# Altium project analog.PrjPcb
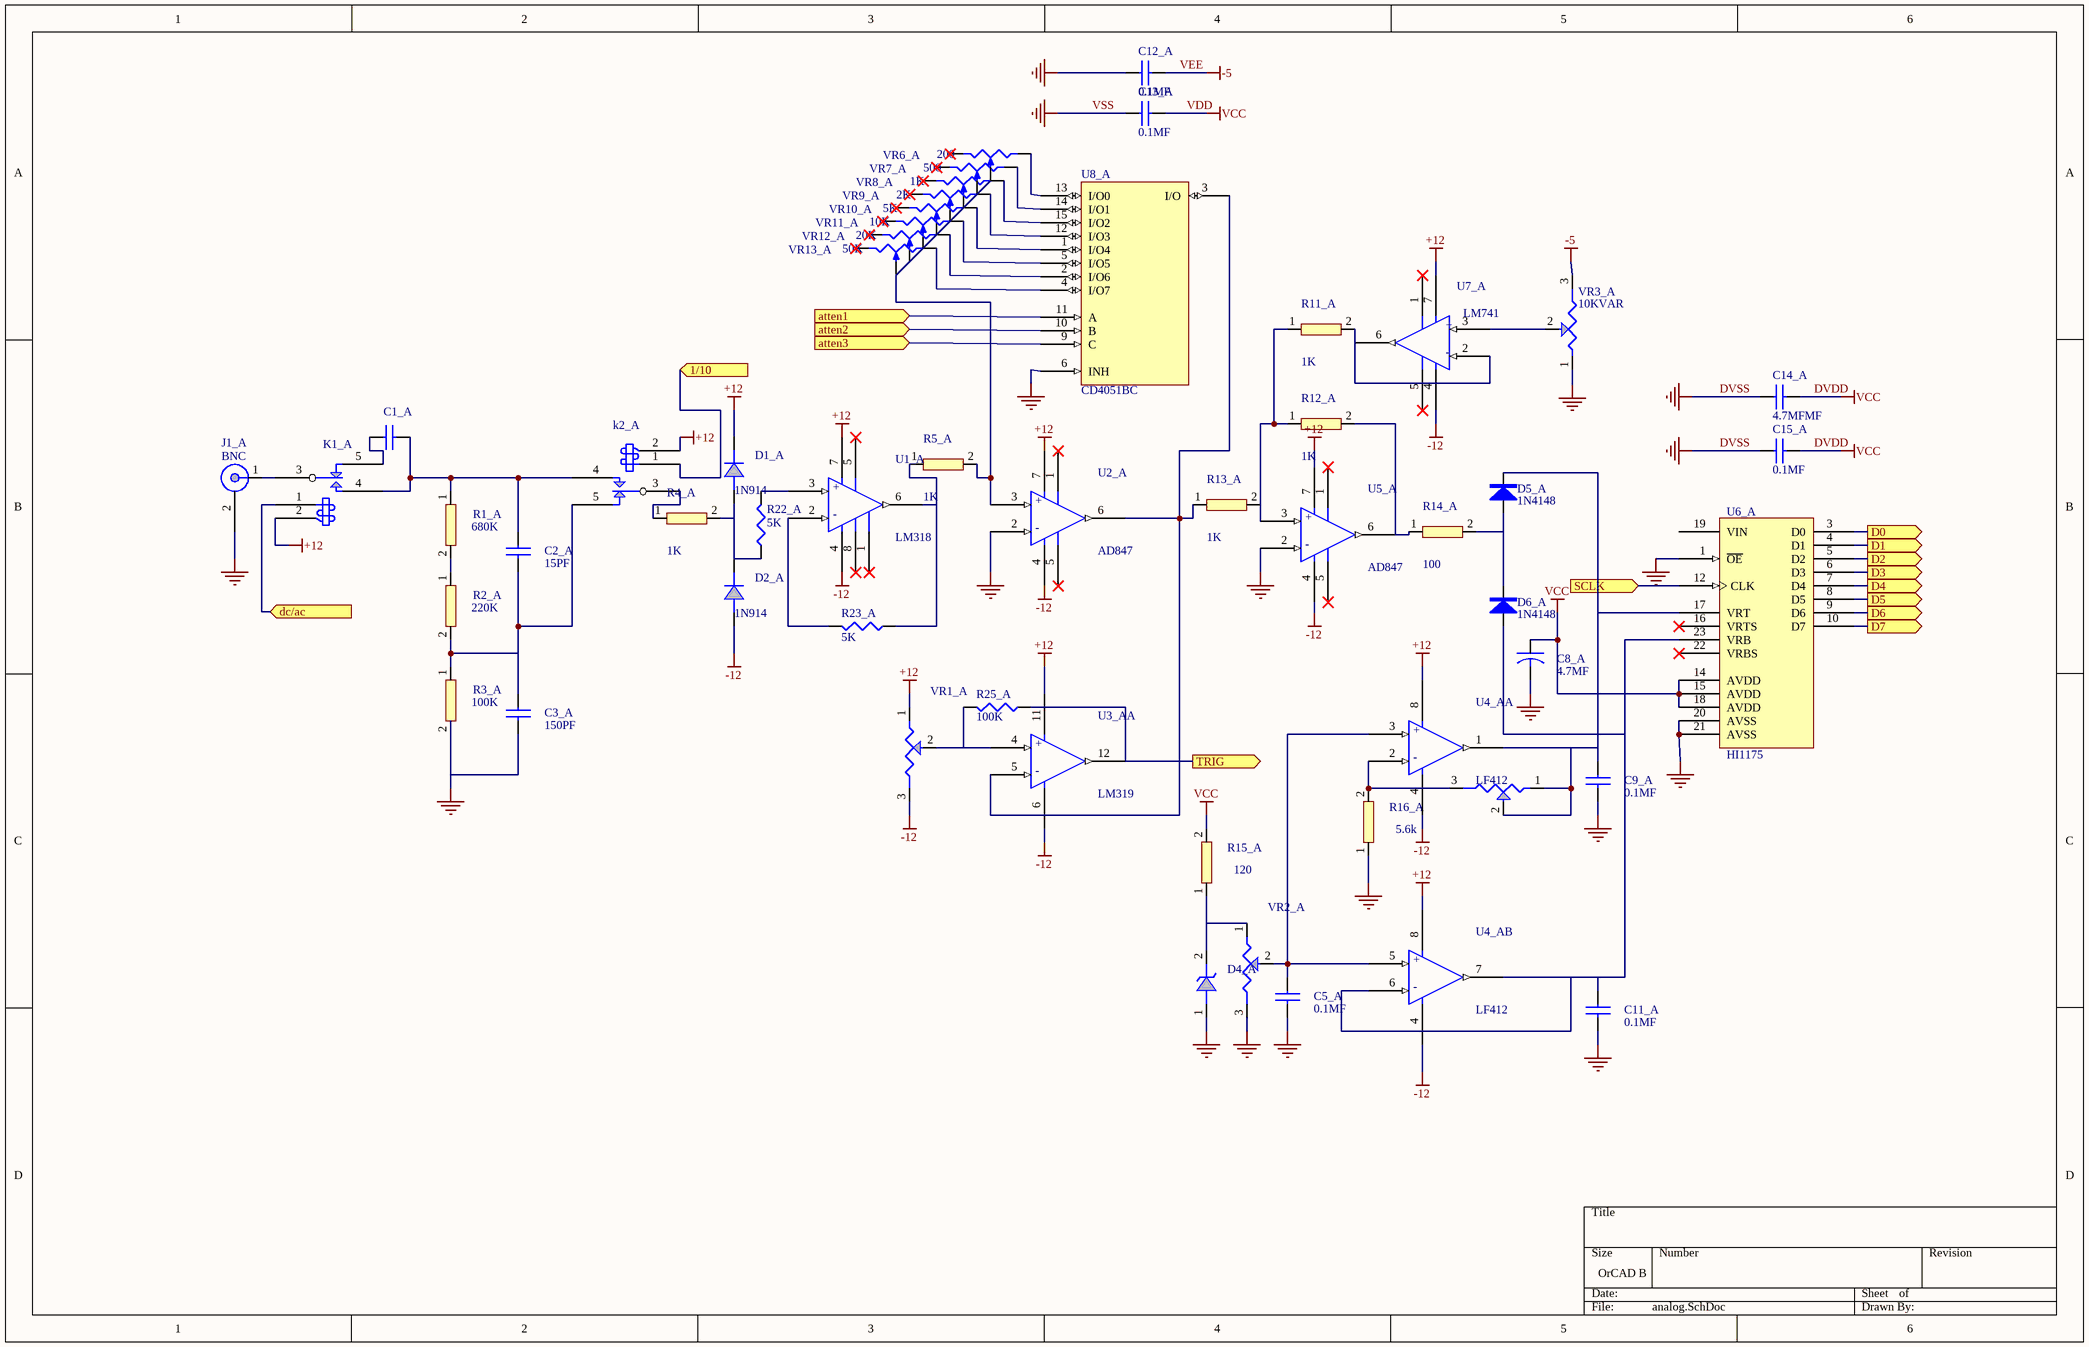
[diagram p0: analog.SchDoc]
1 sheet, 53 parts. Net scope: flat (ports and power ports of the same name join across sheets).

## Sheet analog.SchDoc: RevCode
size OrCAD B; DocumentNumber: Page Create Date; Revision: TitleBlock0; SheetNumber: 1; SheetTotal: 1

### Parts
C1_A  0.1MF  [RAD0.2]  (value not drawn)
C2_A  15PF  [RAD0.2]
C3_A  150PF  [RAD0.2]
C5_A  0.1MF  [RAD0.2]
C8_A  4.7MF  [RAD0.2]
C9_A  0.1MF  [RAD0.2]
C11_A  0.1MF  [RAD0.2]
C12_A  0.1MF  [RAD0.2]
C13_A  0.1MF  [RAD0.2]
C14_A  4.7MFMF  [RAD0.2]
C15_A  0.1MF  [RAD0.2]
D1_A  1N914  [DIODE-0.4]
D2_A  1N914  [DIODE-0.4]
D4_A  ICL8069  [TO46]  (value not drawn)
D5_A  1N4148  [DIODE-0.4]
D6_A  1N4148  [DIODE-0.4]
J1_A  BNC  [BNC_AMP_H]
K1_A  RELAY SPDT  [RELAY41]  (value not drawn)
k2_A  RELAY SPDT  [RELAY41]  (value not drawn)
R1_A  680K  [AXIAL0.3]
R2_A  220K  [AXIAL0.3]
R3_A  100K  [AXIAL0.3]
R4_A  1K  [AXIAL0.3]
R5_A  1K  [AXIAL0.3]
R11_A  1K  [AXIAL0.3]
R12_A  1K  [AXIAL0.3]
R13_A  1K  [AXIAL0.3]
R14_A  100  [AXIAL0.3]
R15_A  120  [AXIAL0.3]
R16_A  5.6k  [AXIAL0.3]
R22_A  5K  [AXIAL0.3]
R23_A  5K  [AXIAL0.3]
R25_A  100K  [AXIAL0.3]
U1_A  LM318  [DIP8]
U2_A  AD847  [DIP8]
U3_A  LM319  [DIP14]  (part A of 2)
U4_A  LF412  [DIP8]  (parts A,B of 2)
U5_A  AD847  [DIP8]
U6_A  HI1175  [SOJ-24]
U7_A  LM741  [DIP8]
U8_A  CD4051BC  [DIP-16]
VR1_A  10KVAR  [VR5]  (value not drawn)
VR2_A  5kvar  [VR5]  (value not drawn)
VR3_A  10KVAR  [VR5]
VR4_A  5kvar  [VR5]  (value not drawn)
VR6_A  200  [VR5]
VR7_A  500  [VR5]
VR8_A  1K  [VR5]
VR9_A  2K  [VR5]
VR10_A  5K  [VR5]
VR11_A  10K  [VR5]
VR12_A  20K  [VR5]
VR13_A  50K  [VR5]

### Ports
1/10 (in), atten1 (in), atten2 (in), atten3 (in), D0 (out), D1 (out), D2 (out), D3 (out), D4 (out), D5 (out), D6 (out), D7 (out), dc/ac (in), SCLK (in), TRIG (out)

### Nets
+12: D1_A.2(CATHODE) K1_A.2(COIL2) k2_A.2(COIL2) U1_A.7(V+) U2_A.7(V+) U3_A.11(V+) U4_A.8(V+) U5_A.7(V+) U7_A.7(V+) VR1_A.1(A)
-12: D2_A.1(ANODE) U1_A.4(V-) U2_A.4(V-) U3_A.6(V-) U4_A.4(V-) U5_A.4(V-) U7_A.4(V-) VR1_A.3(B)
DVDD: C8_A.1 C13_A.2 C14_A.2 C15_A.2 R15_A.2 U6_A.11(DVDD) U6_A.13(DVDD) U6_A.14(AVDD) U6_A.15(AVDD) U6_A.18(AVDD) U8_A.16(VDD)  [also labelled VCC, VDD]
DVSS: C3_A.2 C5_A.2 C8_A.2 C9_A.2 C11_A.2 C12_A.1 C13_A.1 C14_A.1 C15_A.1 D4_A.1(ANODE) J1_A.2(SHIELD) R3_A.2 R16_A.1 U2_A.2(-IN) U3_A.3(GND) U5_A.2(-IN) U6_A.1(~{OE}) U6_A.2(DVSS) U6_A.20(AVSS) U6_A.21(AVSS) U6_A.24(DVSS) U8_A.6(INH) U8_A.8(VSS) VR2_A.3(B) VR3_A.1(A)  [also labelled GND, VSS]
VEE: C12_A.2 U8_A.7(VEE) VR3_A.3(B)  [also labelled -5]
NetC1_A_1: C1_A.1 K1_A.5(NC)
NetC1_A_2: C1_A.2 C2_A.1 K1_A.4(NO) k2_A.4(NO) R1_A.1
NetC2_A_2: C2_A.2 C3_A.1 k2_A.5(NC) R2_A.2 R3_A.1
NetC5_A_1: C5_A.1 U4_A.3(+IN) U4_A.5(+IN) VR2_A.2(WIPER)
NetC9_A_1: C9_A.1 D5_A.2(K) U4_A.1(OUT) U6_A.17(VRT) VR4_A.1(A) VR4_A.2(WIPER)
NetC11_A_1: C11_A.1 D6_A.1(A) U4_A.6(-IN) U4_A.7(OUT) U6_A.23(VRB)
NetD1_A_1: D1_A.1(ANODE) D2_A.2(CATHODE) R4_A.2 R22_A.2(BOT)
NetD4_A_2: D4_A.2(CATHODE) R15_A.1 VR2_A.1(A)
NetD5_A_1: D5_A.1(A) D6_A.2(K) R14_A.2
NetJ1_A_1: J1_A.1(CENTER) K1_A.3(COMMON)
NetK1_A_1: K1_A.1(COIL1) ; port dc/ac
Netk2_A_1: k2_A.1(COIL1) ; port 1/10
Netk2_A_3: k2_A.3(COMMON) R4_A.1
NetR1_A_2: R1_A.2 R2_A.1
NetR5_A_1: R5_A.1 R23_A.2(BOT) U1_A.6(OUT)
NetR5_A_2: R5_A.2 U2_A.3(+IN) VR6_A.3(TAP) VR7_A.3(TAP) VR8_A.3(TAP) VR9_A.3(TAP) VR10_A.3(TAP) VR11_A.3(TAP) VR12_A.3(TAP) VR13_A.3(TAP)
NetR11_A_1: R11_A.1 R12_A.1 R13_A.2 U5_A.3(+IN)
NetR11_A_2: R11_A.2 U7_A.2(-IN) U7_A.6(OUT)
NetR12_A_2: R12_A.2 R14_A.1 U5_A.6(OUT)
NetR13_A_1: R13_A.1 U2_A.6(OUT) U3_A.5(-IN) U8_A.3(I/O)
NetR16_A_2: R16_A.2 U4_A.2(-IN) VR4_A.3(B)
NetR22_A_1: R22_A.1(TOP) U1_A.3(+IN)
NetR23_A_1: R23_A.1(TOP) U1_A.2(-IN)
NetR25_A_1: R25_A.1(TOP) U3_A.4(+IN) VR1_A.2(WIPER)
NetR25_A_2: R25_A.2(BOT) U3_A.12(OUT) ; port TRIG
NetU6_A_3: U6_A.3(D0) ; port D0
NetU6_A_4: U6_A.4(D1) ; port D1
NetU6_A_5: U6_A.5(D2) ; port D2
NetU6_A_6: U6_A.6(D3) ; port D3
NetU6_A_7: U6_A.7(D4) ; port D4
NetU6_A_8: U6_A.8(D5) ; port D5
NetU6_A_9: U6_A.9(D6) ; port D6
NetU6_A_10: U6_A.10(D7) ; port D7
NetU6_A_12: U6_A.12(CLK) ; port SCLK
NetU7_A_3: U7_A.3(+IN) VR3_A.2(WIPER)
NetU8_A_1: U8_A.1(I/O4) VR10_A.2(BOT)
NetU8_A_2: U8_A.2(I/O6) VR12_A.2(BOT)
NetU8_A_4: U8_A.4(I/O7) VR13_A.2(BOT)
NetU8_A_5: U8_A.5(I/O5) VR11_A.2(BOT)
NetU8_A_9: U8_A.9(C) ; port atten3
NetU8_A_10: U8_A.10(B) ; port atten2
NetU8_A_11: U8_A.11(A) ; port atten1
NetU8_A_12: U8_A.12(I/O3) VR9_A.2(BOT)
NetU8_A_13: U8_A.13(I/O0) VR6_A.2(BOT)
NetU8_A_14: U8_A.14(I/O1) VR7_A.2(BOT)
NetU8_A_15: U8_A.15(I/O2) VR8_A.2(BOT)

Not connected (* = marked no-connect by the designer): U1_A 1(COMP3)* 5(COMP1)* 8(COMP2)*; U2_A 1(OFFSET1)* 5(OFFSET2)*; U5_A 1(OFFSET1)* 5(OFFSET2)*; U6_A 16(VRTS)* 19(VIN) 22(VRBS)*; U7_A 1(OFFSET1)* 5(OFFSET2)*; VR6_A 1(TOP)*; VR7_A 1(TOP)*; VR8_A 1(TOP)*; VR9_A 1(TOP)*; VR10_A 1(TOP)*; VR11_A 1(TOP)*; VR12_A 1(TOP)*; VR13_A 1(TOP)*

### Notes on the sheet
- (in symbol AD847) +; -
- (in symbol LF412, part A) +; -
- (in symbol LF412, part B) +; -
- (in symbol LM318) +; -
- (in symbol LM319, part A) +; -
- (in symbol LM741) +; -

### Library data of the parts
C1_A C2_A C3_A C5_A C9_A C11_A C12_A C13_A C14_A C15_A = CAP NP: Text Field1: 20; Text Field2: 10
C8_A = C: Text Field1: 20; Text Field2: 10
D1_A D2_A = DIODE: Text Field1: 30; Text Field2: 20
D4_A = DIODE ZENER1: Text Field1: 30; Text Field2: 20
D5_A D6_A = 1N4148: Diode
J1_A = BNC: Text Field1: 20; Text Field2: 20
K1_A k2_A = RELAY SPDT: Text Field1: 20; Text Field2: 60
R1_A R2_A R3_A R4_A R5_A R11_A R12_A R13_A R14_A R15_A R16_A = R2: Text Field1: 20; Text Field2: 30
R22_A R23_A R25_A = RES: Resistor
  R22_A R23_A: Value: 5K
  R25_A: Value: 100K
U1_A = LM318: Text Field1: 40; Text Field2: 40
U2_A U5_A = AD847: Text Field1: 40; Text Field2: 40
U3_A = LM319: Text Field1: 40; Text Field2: 40
U4_A = LF412: Text Field1: 40; Text Field2: 40
U6_A = HI1175: Text Field1: 70; Text Field2: 170
U7_A = LM741: Text Field1: 40; Text Field2: 40
VR1_A VR2_A VR3_A VR4_A = RESISTOR VAR: Text Field1: 50; Text Field2: 20
VR6_A VR7_A VR8_A VR9_A VR10_A VR11_A VR12_A VR13_A = RPOT: Potentiometer
  VR6_A: Value: 200
  VR7_A: Value: 500
  VR8_A: Value: 1K
  VR9_A: Value: 2K
  VR10_A: Value: 5K
  VR11_A: Value: 10K
  VR12_A: Value: 20K
  VR13_A: Value: 50K